# Altium schematic sheet mcu.SchDoc
size A3; DocumentNumber: 22; SheetNumber: 22; SheetTotal: 45; SheetDescription: Microcontroller Unit
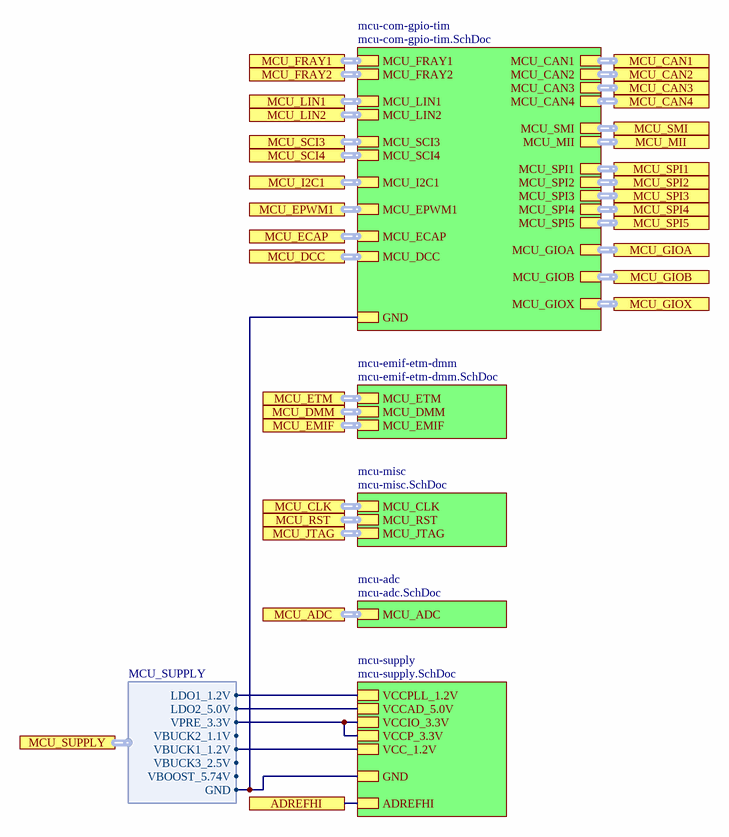
[diagram p0: mcu.SchDoc]

## Sub-sheets
mcu-adc = mcu-adc.SchDoc: MCU_ADC (harness MCU_ADC)
mcu-com-gpio-tim = mcu-com-gpio-tim.SchDoc: MCU_FRAY1 (harness MCU_FRAY), MCU_LIN1 (harness MCU_LIN), MCU_SPI1 (harness MCU_SPI1), MCU_MII (harness MCU_MII), MCU_SPI3 (harness MCU_SPI3), MCU_SMI (harness MCU_SMI), MCU_SPI5 (harness MCU_SPI5), MCU_LIN2 (harness MCU_LIN), MCU_SPI4 (harness MCU_SPI4), MCU_SPI2 (harness MCU_SPI2), MCU_EPWM1 (harness MCU_EPWM), MCU_I2C1 (harness MCU_I2C), MCU_SCI3 (harness MCU_SCI), MCU_CAN1 (harness MCU_CAN), MCU_CAN2 (harness MCU_CAN), MCU_FRAY2 (harness MCU_FRAY), MCU_CAN4 (harness MCU_CAN), MCU_CAN3 (harness MCU_CAN), MCU_SCI4 (harness MCU_SCI), MCU_ECAP (harness MCU_ECAP), MCU_DCC (harness MCU_DCC), MCU_GIOB (harness MCU_GIOB), MCU_GIOA (harness MCU_GIOA), GND, MCU_GIOX (harness MCU_GIOX)
mcu-emif-etm-dmm = mcu-emif-etm-dmm.SchDoc: MCU_ETM (harness MCU_ETM), MCU_DMM (harness MCU_DMM), MCU_EMIF (harness MCU_EMIF)
mcu-misc = mcu-misc.SchDoc: MCU_CLK (harness CLOCK), MCU_RST (harness MCU_RST), MCU_JTAG (harness MCU_JTAG)
mcu-supply = mcu-supply.SchDoc: VCCP_3.3V, VCCAD_5.0V, VCCPLL_1.2V, VCC_1.2V, VCCIO_3.3V, GND, ADREFHI

## Ports
ADREFHI, MCU_ADC (harness MCU_ADC), MCU_CAN1 (harness MCU_CAN), MCU_CAN2 (harness MCU_CAN), MCU_CAN3 (harness MCU_CAN), MCU_CAN4 (harness MCU_CAN), MCU_CLK (harness CLOCK), MCU_DCC (harness MCU_DCC), MCU_DMM (harness MCU_DMM), MCU_ECAP (harness MCU_ECAP), MCU_EMIF (harness MCU_EMIF), MCU_EPWM1 (harness MCU_EPWM), MCU_ETM (harness MCU_ETM), MCU_FRAY1 (harness MCU_FRAY), MCU_FRAY2 (harness MCU_FRAY), MCU_GIOA (harness MCU_GIOA), MCU_GIOB (harness MCU_GIOB), MCU_GIOX (harness MCU_GIOX), MCU_I2C1 (harness MCU_I2C), MCU_JTAG (harness MCU_JTAG), MCU_LIN1 (harness MCU_LIN), MCU_LIN2 (harness MCU_LIN), MCU_MII (harness MCU_MII), MCU_RST (harness MCU_RST), MCU_SCI3 (harness MCU_SCI), MCU_SCI4 (harness MCU_SCI), MCU_SMI (harness MCU_SMI), MCU_SPI1 (harness MCU_SPI1), MCU_SPI2 (harness MCU_SPI2), MCU_SPI3 (harness MCU_SPI3), MCU_SPI4 (harness MCU_SPI4), MCU_SPI5 (harness MCU_SPI5), MCU_SUPPLY (harness MCU_SUPPLY)

## Harnesses
MCU_SUPPLY: VBUCK1_1.2V, VBUCK2_1.1V, VBUCK3_2.5V, LDO1_1.2V, LDO2_5.0V, GND, VPRE_3.3V, VBOOST_5.74V

## Nets
ADREFHI: port ADREFHI, sheet mcu-supply/ADREFHI
(unnamed): sheet mcu-com-gpio-tim/GND, sheet mcu-supply/GND, port MCU_SUPPLY.GND
(unnamed): sheet mcu-supply/VCCP_3.3V, sheet mcu-supply/VCCIO_3.3V, port MCU_SUPPLY.VPRE_3.3V
(unnamed): sheet mcu-supply/VCCAD_5.0V, port MCU_SUPPLY.LDO2_5.0V
(unnamed): sheet mcu-supply/VCCPLL_1.2V, port MCU_SUPPLY.LDO1_1.2V
(unnamed): sheet mcu-supply/VCC_1.2V, port MCU_SUPPLY.VBUCK1_1.2V

## Buses and harness runs
harness port MCU_ADC = sheet mcu-adc/MCU_ADC
harness port MCU_CAN1 = sheet mcu-com-gpio-tim/MCU_CAN1
harness port MCU_CAN2 = sheet mcu-com-gpio-tim/MCU_CAN2
harness port MCU_CAN3 = sheet mcu-com-gpio-tim/MCU_CAN3
harness port MCU_CAN4 = sheet mcu-com-gpio-tim/MCU_CAN4
harness port MCU_CLK = sheet mcu-misc/MCU_CLK
harness port MCU_DCC = sheet mcu-com-gpio-tim/MCU_DCC
harness port MCU_DMM = sheet mcu-emif-etm-dmm/MCU_DMM
harness port MCU_ECAP = sheet mcu-com-gpio-tim/MCU_ECAP
harness port MCU_EMIF = sheet mcu-emif-etm-dmm/MCU_EMIF
harness port MCU_EPWM1 = sheet mcu-com-gpio-tim/MCU_EPWM1
harness port MCU_ETM = sheet mcu-emif-etm-dmm/MCU_ETM
harness port MCU_FRAY1 = sheet mcu-com-gpio-tim/MCU_FRAY1
harness port MCU_FRAY2 = sheet mcu-com-gpio-tim/MCU_FRAY2
harness port MCU_GIOA = sheet mcu-com-gpio-tim/MCU_GIOA
harness port MCU_GIOB = sheet mcu-com-gpio-tim/MCU_GIOB
harness port MCU_GIOX = sheet mcu-com-gpio-tim/MCU_GIOX
harness port MCU_I2C1 = sheet mcu-com-gpio-tim/MCU_I2C1
harness port MCU_JTAG = sheet mcu-misc/MCU_JTAG
harness port MCU_LIN1 = sheet mcu-com-gpio-tim/MCU_LIN1
harness port MCU_LIN2 = sheet mcu-com-gpio-tim/MCU_LIN2
harness port MCU_MII = sheet mcu-com-gpio-tim/MCU_MII
harness port MCU_RST = sheet mcu-misc/MCU_RST
harness port MCU_SCI3 = sheet mcu-com-gpio-tim/MCU_SCI3
harness port MCU_SCI4 = sheet mcu-com-gpio-tim/MCU_SCI4
harness port MCU_SMI = sheet mcu-com-gpio-tim/MCU_SMI
harness port MCU_SPI1 = sheet mcu-com-gpio-tim/MCU_SPI1
harness port MCU_SPI2 = sheet mcu-com-gpio-tim/MCU_SPI2
harness port MCU_SPI3 = sheet mcu-com-gpio-tim/MCU_SPI3
harness port MCU_SPI4 = sheet mcu-com-gpio-tim/MCU_SPI4
harness port MCU_SPI5 = sheet mcu-com-gpio-tim/MCU_SPI5

## Notes on the sheet
- Fraunhofer IISB
- Schottkystr. 10
- developed by:
- 91058 Erlangen
- Germany
- Author
- Project
- License
- Description
- File
- Version
- Release Date
- Sheet
- foxbms.org <https://foxbms.org>
- www.iisb.fraunhofer.de <https://www.iisb.fraunhofer.de/>
- foxBMS Team
- /